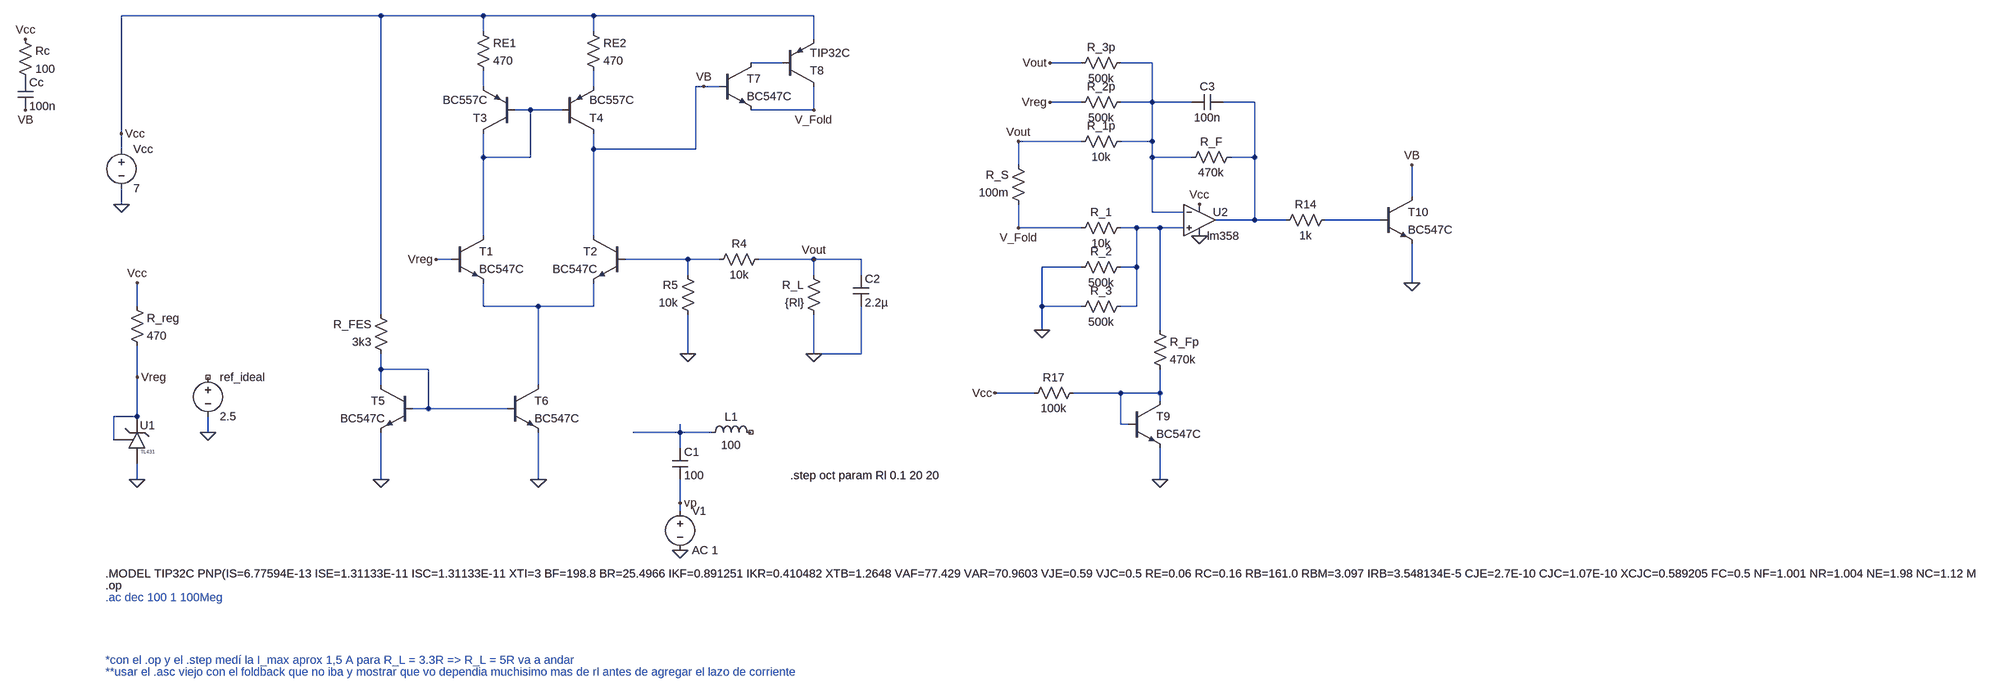
[diagram p0: schematic Checkpoint2-Rev1(CR_Compensacion_IT1).asc]
Checkpoint2-Rev1(CR_Compensacion_IT1).asc, the LTspice schematic file:
Version 4.1
SHEET 1 6416 1460
WIRE -144 -320 -672 -320
WIRE 64 -320 -144 -320
WIRE 288 -320 64 -320
WIRE 736 -320 288 -320
WIRE 64 -288 64 -320
WIRE 288 -288 288 -320
WIRE 736 -272 736 -320
WIRE 672 -224 608 -224
WIRE 1280 -224 1216 -224
WIRE 1424 -224 1360 -224
WIRE 64 -176 64 -208
WIRE 288 -176 288 -208
WIRE 512 -176 496 -176
WIRE 544 -176 512 -176
WIRE 1280 -144 1216 -144
WIRE 1424 -144 1424 -224
WIRE 1424 -144 1360 -144
WIRE 1504 -144 1424 -144
WIRE 1632 -144 1568 -144
WIRE 160 -128 128 -128
WIRE 224 -128 160 -128
WIRE 736 -128 736 -176
WIRE 736 -128 608 -128
WIRE -672 -80 -672 -320
WIRE 1280 -64 1152 -64
WIRE 1424 -64 1424 -144
WIRE 1424 -64 1360 -64
WIRE -672 -48 -672 -80
WIRE 288 -48 288 -80
WIRE 496 -48 496 -176
WIRE 496 -48 288 -48
WIRE 64 -32 64 -80
WIRE 160 -32 160 -128
WIRE 160 -32 64 -32
WIRE 1424 -32 1424 -64
WIRE 1504 -32 1424 -32
WIRE 1632 -32 1632 -144
WIRE 1632 -32 1584 -32
WIRE 1152 -16 1152 -64
WIRE 1952 48 1952 -16
WIRE -672 64 -672 32
WIRE 1424 80 1424 -32
WIRE 1488 80 1424 80
WIRE 1632 96 1632 -32
WIRE 1632 96 1552 96
WIRE 1696 96 1632 96
WIRE 1888 96 1776 96
WIRE 1152 112 1152 64
WIRE 1280 112 1152 112
WIRE 1392 112 1360 112
WIRE 1440 112 1392 112
WIRE 1488 112 1440 112
WIRE 64 128 64 -32
WIRE 288 128 288 -48
WIRE 0 176 -32 176
WIRE 480 176 352 176
WIRE 544 176 480 176
WIRE 736 176 624 176
WIRE 832 176 736 176
WIRE 1280 192 1200 192
WIRE 1392 192 1392 112
WIRE 1392 192 1360 192
WIRE 480 208 480 176
WIRE 736 208 736 176
WIRE 832 208 832 176
WIRE 1952 224 1952 144
WIRE -640 272 -640 224
WIRE 64 272 64 224
WIRE 176 272 64 272
WIRE 288 272 288 224
WIRE 288 272 176 272
WIRE 1200 272 1200 192
WIRE 1280 272 1200 272
WIRE 1392 272 1392 192
WIRE 1392 272 1360 272
WIRE -144 288 -144 -320
WIRE 1200 320 1200 272
WIRE 1440 320 1440 112
WIRE 480 368 480 288
WIRE 736 368 736 288
WIRE 832 368 832 272
WIRE 832 368 736 368
WIRE -144 400 -144 368
WIRE -48 400 -144 400
WIRE -640 416 -640 352
WIRE -144 432 -144 400
WIRE 176 432 176 272
WIRE 1184 448 1104 448
WIRE 1360 448 1264 448
WIRE 1440 448 1440 400
WIRE 1440 448 1360 448
WIRE 1440 464 1440 448
WIRE -48 480 -48 400
WIRE -48 480 -80 480
WIRE 112 480 -48 480
WIRE -640 496 -640 416
WIRE -640 496 -688 496
WIRE 1360 512 1360 448
WIRE 1376 512 1360 512
WIRE -496 528 -496 496
WIRE 464 528 464 512
WIRE 464 528 368 528
WIRE 528 528 464 528
WIRE -688 544 -688 496
WIRE 464 560 464 528
WIRE -640 624 -640 592
WIRE -144 624 -144 528
WIRE 176 624 176 528
WIRE 1440 624 1440 560
WIRE 464 672 464 624
WIRE 464 688 464 672
FLAG 480 368 0
FLAG 736 368 0
FLAG -672 64 0
FLAG -496 528 0
FLAG 464 768 0
FLAG 176 624 0
FLAG -144 624 0
FLAG 1440 624 0
FLAG 1104 448 Vcc
FLAG 1200 320 0
FLAG 1952 224 0
FLAG 1952 -16 VB
FLAG 1216 -224 Vout
FLAG 1216 -144 Vreg
FLAG 512 -176 VB
FLAG 736 176 Vout
FLAG 1152 -64 Vout
FLAG 736 -128 V_Fold
FLAG 1152 112 V_Fold
FLAG -672 -80 Vcc
FLAG 1520 64 Vcc
FLAG 1520 128 0
FLAG -32 176 Vreg
FLAG -640 416 Vreg
FLAG -640 624 0
FLAG -640 224 Vcc
FLAG 464 672 vp
FLAG -1072 -272 Vcc
FLAG -1072 -128 VB
SYMBOL npn 0 128 R0
SYMATTR InstName T1
SYMATTR Value BC547C
SYMBOL npn 352 128 M0
SYMATTR InstName T2
SYMATTR Value BC547C
SYMBOL res 640 160 R90
WINDOW 0 0 56 VBottom 2
WINDOW 3 32 56 VTop 2
SYMATTR InstName R4
SYMATTR Value 10k
SYMBOL res 496 304 R180
WINDOW 0 36 76 Left 2
WINDOW 3 36 40 Left 2
SYMATTR InstName R5
SYMATTR Value 10k
SYMBOL res 752 304 R180
WINDOW 0 36 76 Left 2
WINDOW 3 36 40 Left 2
SYMATTR InstName R_L
SYMATTR Value {Rl}
SYMBOL voltage -496 400 R0
SYMATTR InstName ref_ideal
SYMATTR Value 2.5
SYMBOL voltage -672 -64 R0
WINDOW 123 0 0 Left 0
WINDOW 39 0 0 Left 0
SYMATTR InstName Vcc
SYMATTR Value 7
SYMBOL ind 512 544 R270
WINDOW 0 32 56 VTop 2
WINDOW 3 5 56 VBottom 2
SYMATTR InstName L1
SYMATTR Value 100
SYMBOL cap 448 560 R0
SYMATTR InstName C1
SYMATTR Value 100
SYMBOL voltage 464 672 R0
SYMATTR InstName V1
SYMATTR Value AC 1
SYMBOL pnp 224 -80 M180
SYMATTR InstName T4
SYMATTR Value BC557C
SYMBOL pnp 128 -80 R180
SYMATTR InstName T3
SYMATTR Value BC557C
SYMBOL res -128 384 R180
WINDOW 0 36 76 Left 2
WINDOW 3 36 40 Left 2
SYMATTR InstName R_FES
SYMATTR Value 3k3
SYMBOL npn 112 432 R0
SYMATTR InstName T6
SYMATTR Value BC547C
SYMBOL npn -80 432 M0
SYMATTR InstName T5
SYMATTR Value BC547C
SYMBOL pnp 672 -176 M180
SYMATTR InstName T8
SYMATTR Value TIP32C
SYMBOL npn 544 -224 R0
SYMATTR InstName T7
SYMATTR Value BC547C
SYMBOL res 1376 -80 R90
WINDOW 0 0 56 VBottom 2
WINDOW 3 32 56 VTop 2
SYMATTR InstName R_1p
SYMATTR Value 10k
SYMBOL res 1376 96 R90
WINDOW 0 0 56 VBottom 2
WINDOW 3 32 56 VTop 2
SYMATTR InstName R_1
SYMATTR Value 10k
SYMBOL res 1376 176 R90
WINDOW 0 0 56 VBottom 2
WINDOW 3 32 56 VTop 2
SYMATTR InstName R_2
SYMATTR Value 500k
SYMBOL res 1376 256 R90
WINDOW 0 0 56 VBottom 2
WINDOW 3 32 56 VTop 2
SYMATTR InstName R_3
SYMATTR Value 500k
SYMBOL res 1376 -160 R90
WINDOW 0 0 56 VBottom 2
WINDOW 3 32 56 VTop 2
SYMATTR InstName R_2p
SYMATTR Value 500k
SYMBOL res 1376 -240 R90
WINDOW 0 0 56 VBottom 2
WINDOW 3 32 56 VTop 2
SYMATTR InstName R_3p
SYMATTR Value 500k
SYMBOL res 1600 -48 R90
WINDOW 0 0 56 VBottom 2
WINDOW 3 32 56 VTop 2
SYMATTR InstName R_F
SYMATTR Value 470k
SYMBOL res 1792 80 R90
WINDOW 0 0 56 VBottom 2
WINDOW 3 32 56 VTop 2
SYMATTR InstName R14
SYMATTR Value 1k
SYMBOL res 1424 304 R0
SYMATTR InstName R_Fp
SYMATTR Value 470k
SYMBOL res 1168 464 R270
WINDOW 0 32 56 VTop 2
WINDOW 3 0 56 VBottom 2
SYMATTR InstName R17
SYMATTR Value 100k
SYMBOL res 1168 80 R180
WINDOW 0 36 76 Left 2
WINDOW 3 36 40 Left 2
SYMATTR InstName R_S
SYMATTR Value 100m
SYMBOL npn 1376 464 R0
SYMATTR InstName T9
SYMATTR Value BC547C
SYMBOL npn 1888 48 R0
SYMATTR InstName T10
SYMATTR Value BC547C
SYMBOL References\\TL431 -640 544 R0
WINDOW 3 7 24 Left 0
WINDOW 0 6 -30 Left 2
SYMATTR InstName U1
SYMBOL res -656 256 R0
SYMATTR InstName R_reg
SYMATTR Value 470
SYMBOL res 48 -304 R0
SYMATTR InstName RE1
SYMATTR Value 470
SYMBOL res 272 -304 R0
SYMATTR InstName RE2
SYMATTR Value 470
SYMBOL OpAmps\\lm358 1520 32 R0
WINDOW 0 27 48 Left 2
WINDOW 38 26 80 Left 2
SYMATTR InstName U2
SYMBOL cap 816 208 R0
SYMATTR InstName C2
SYMATTR Value 2.2µ
SYMBOL res -1088 -288 R0
SYMATTR InstName Rc
SYMATTR Value 100
SYMBOL cap -1088 -192 R0
SYMATTR InstName Cc
SYMATTR Value 100n
SYMBOL cap 1568 -160 R90
WINDOW 0 0 32 VBottom 2
WINDOW 3 32 32 VTop 2
SYMATTR InstName C3
SYMATTR Value 100n
TEXT -704 816 Left 2 !.MODEL TIP32C PNP(IS=6.77594E-13 ISE=1.31133E-11 ISC=1.31133E-11 XTI=3 BF=198.8 BR=25.4966 IKF=0.891251 IKR=0.410482 XTB=1.2648 VAF=77.429 VAR=70.9603 VJE=0.59 VJC=0.5 RE=0.06 RC=0.16 RB=161.0 RBM=3.097 IRB=3.548134E-5 CJE=2.7E-10 CJC=1.07E-10 XCJC=0.589205 FC=0.5 NF=1.001 NR=1.004 NE=1.98 NC=1.12 MJE=0.319 MJC=0.352 TF=2.3733E-8 TR=1.0000E-8 ITF=1 VTF=10 XTF=10 EG=1.0863 VCEO=100 ICRATING=3 MFG=TEXAS)
TEXT -704 1000 Left 2 ;*con el .op y el .step medí la I_max aprox 1,5 A para R_L = 3.3R => R_L = 5R va a andar
TEXT -704 1024 Left 2 ;**usar el .asc viejo con el foldback que no iba y mostrar que vo dependia muchisimo mas de rl antes de agregar el lazo de corriente
TEXT -704 840 Left 2 !.op
TEXT 688 616 Left 2 !.step oct param Rl 0.1 20 20
TEXT -704 864 Left 2 ;.ac dec 100 1 100Meg

The netlist it stands for:
* Checkpoint2-Rev1(CR_Compensacion_IT1).asc
Q§T1 N006 Vreg N010 0 BC547C
Q§T2 VB N009 N010 0 BC547C
R4 Vout N009 10k
R5 0 N009 10k
R_L 0 Vout {Rl}
V§ref_ideal NC_01 0 2.5
Vcc Vcc 0 7
L1 N013 NC_02 100
C1 N013 vp 100
V1 vp 0 AC 1
Q§T4 VB N006 N004 0 BC557C
Q§T3 N006 N006 N003 0 BC557C
R_FES N011 Vcc 3k3
Q§T6 N010 N011 0 0 BC547C
Q§T5 N011 N011 0 0 BC547C
Q§T8 V_Fold N001 Vcc 0 TIP32C
Q§T7 N001 VB V_Fold 0 BC547C
R_1p N002 Vout 10k
R_1 N008 V_Fold 10k
R_2 N008 0 500k
R_3 N008 0 500k
R_2p N002 Vreg 500k
R_3p N002 Vout 500k
R_F N005 N002 470k
R14 N007 N005 1k
R_Fp N008 N012 470k
R17 Vcc N012 100k
R_S V_Fold Vout 100m
Q§T9 N012 N012 0 0 BC547C
Q§T10 VB N007 0 0 BC547C
X§U1 Vreg 0 Vreg TL431  ; pins CATHODE ANODE REF
R_reg Vcc Vreg 470
RE1 Vcc N003 470
RE2 Vcc N004 470
X§U2 N008 N002 Vcc 0 N005 lm358  ; pins In+ In- V+ V- OUT
C2 Vout 0 2.2µ
Rc Vcc P001 100
Cc P001 VB 100n
C3 N005 N002 100n
.model NPN NPN
.model PNP PNP
.lib standard.bjt
.MODEL TIP32C PNP(IS=6.77594E-13 ISE=1.31133E-11 ISC=1.31133E-11 XTI=3 BF=198.8 BR=25.4966 IKF=0.891251 IKR=0.410482 XTB=1.2648 VAF=77.429 VAR=70.9603 VJE=0.59 VJC=0.5 RE=0.06 RC=0.16 RB=161.0 RBM=3.097 IRB=3.548134E-5 CJE=2.7E-10 CJC=1.07E-10 XCJC=0.589205 FC=0.5 NF=1.001 NR=1.004 NE=1.98 NC=1.12 MJE=0.319 MJC=0.352 TF=2.3733E-8 TR=1.0000E-8 ITF=1 VTF=10 XTF=10 EG=1.0863 VCEO=100 ICRATING=3 MFG=TEXAS)
* *con el .op y el .step medí la I_max aprox 1,5 A para R_L = 3.3R => R_L = 5R va a andar
* **usar el .asc viejo con el foldback que no iba y mostrar que vo dependia muchisimo mas de rl antes de agregar el lazo de corriente
.op
.step oct param Rl 0.1 20 20
* .ac dec 100 1 100Meg
.lib TL431.sub
.backanno
.end